# Altium schematic sheet SwitcherBoard.SchDoc
size A4
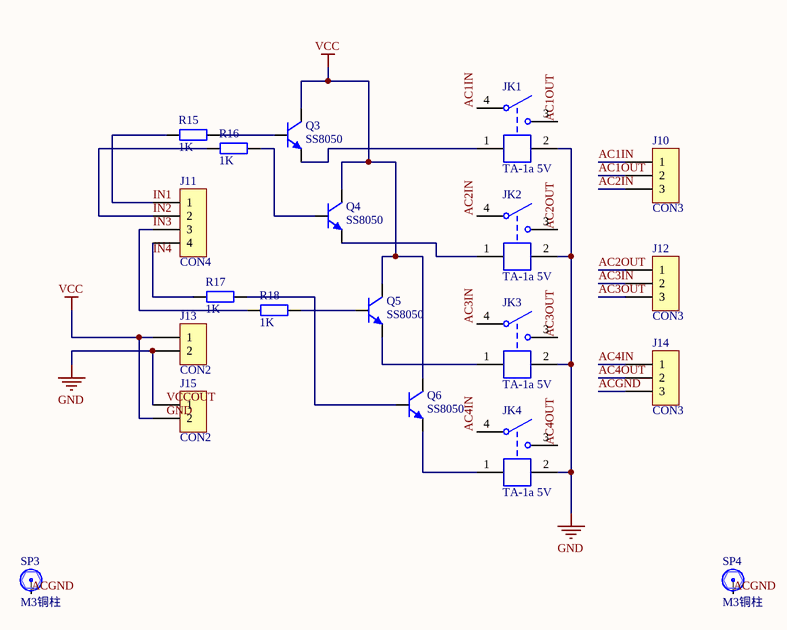
[diagram p0: SwitcherBoard.SchDoc]

## Parts
J10  CON3  [KF128-5.08-3P]
J11  CON4  [HDR2.54-WI-4P]
J12  CON3  [KF128-5.08-3P]
J13  CON2  [HDR2.54-WI-2P]
J14  CON3  [KF128-5.08-3P]
J15  CON2  [HDR2.54-WI-2P]
JK1  TA-1a 5V  [TA-1a]
JK2  TA-1a 5V  [TA-1a]
JK3  TA-1a 5V  [TA-1a]
JK4  TA-1a 5V  [TA-1a]
Q3  SS8050  [TO92A]
Q4  SS8050  [TO92A]
Q5  SS8050  [TO92A]
Q6  SS8050  [TO92A]
R15  1K  [RS 1/4W]
R16  1K  [RS 1/4W]
R17  1K  [RS 1/4W]
R18  1K  [RS 1/4W]
SP3  M3铜柱  [M3x4_L]
SP4  M3铜柱  [M3x4_L]

## Nets
GND: J13.2 J15.1 JK1.2 JK2.2 JK3.2 JK4.2
VCC: J13.1 J15.2 Q3.3(C) Q4.3(C) Q5.3(C) Q6.3(C)
AC1IN: J10.1 JK1.4
AC1OUT: J10.2 JK1.3
AC2IN: J10.3 JK2.4
AC2OUT: J12.1 JK2.3
AC3IN: J12.2 JK3.4
AC3OUT: J12.3 JK3.3
AC4IN: J14.1 JK4.4
AC4OUT: J14.2 JK4.3
ACGND: J14.3 SP3.1 SP4.1
IN1: J11.1 R15.1
IN2: J11.2 R16.1
IN3: J11.3 R18.1
IN4: J11.4 R17.1
NetJK1_1: JK1.1 Q3.1(E)
NetJK2_1: JK2.1 Q4.1(E)
NetJK3_1: JK3.1 Q5.1(E)
NetJK4_1: JK4.1 Q6.1(E)
NetQ3_2: Q3.2(B) R15.2
NetQ4_2: Q4.2(B) R16.2
NetQ5_2: Q5.2(B) R18.2
NetQ6_2: Q6.2(B) R17.2

## Notes on the sheet
- Labels drawn without touching a wire or pin: GND, VCCOUT

## Library data of the parts
J10 J12 J14 = CON3: Connector
J11 = CON4: Connector
J13 J15 = CON2: Connector
JK1-JK4 = TA-1a: 一组常开; BOM名称: 一组常开继电器; 版权归属: 源创客; 学习资源: www.ooocke.com
Q3-Q6 = 8050-DIP: 高频放大-NPN型; 版权归属: 源创客; 属性: 40V 1.5A 1W 100MHZ; BOM名称: 高频放大-NPN型; 学习资源: www.ooocke.com
R15-R18 = R-CRR: 直插色环电阻; BOM名称: 色环电阻; 版权归属: 源创客; 学习资源: www.ooocke.com
SP3 SP4 = 铜柱小焊盘: 铜柱; 版权归属: 源创客; BOM名称: 铜柱; 学习资源: www.ooocke.com